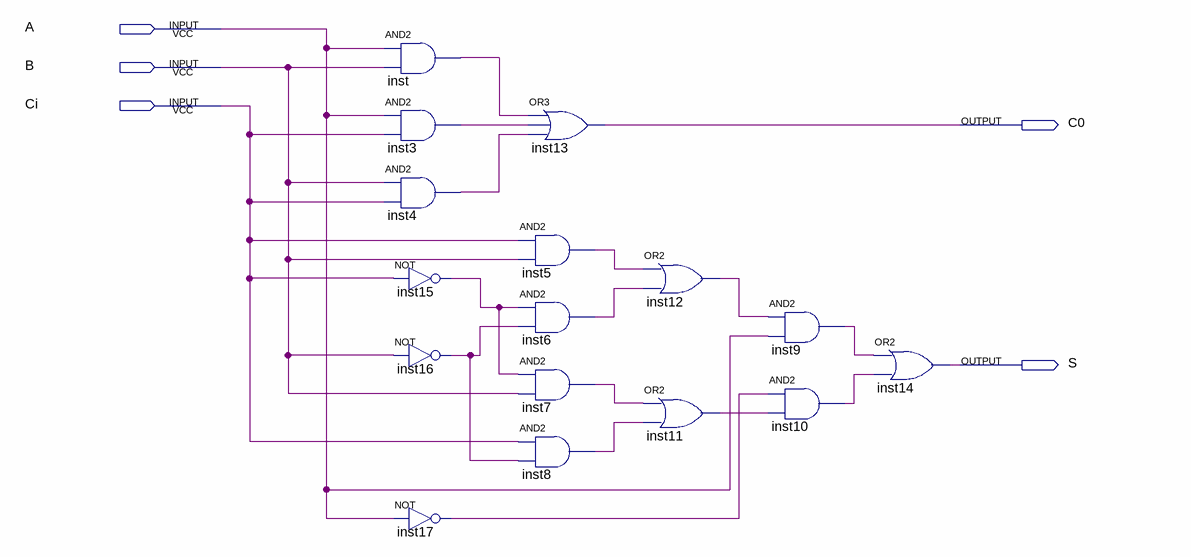
[diagram p0: schematic sheet]
// Quartus schematic fulladder_1b.bdf as structural Verilog: 16 symbols, 5 pins
module fulladder_1b (
  input  A,
  input  B,
  input  Ci,
  output C0,
  output S
);

  wire inst3_out, inst4_out, inst5_out, inst6_out, inst7_out, inst8_out, inst9_out, inst10_out, inst11_out,
       inst12_out, inst15_out, inst16_out, inst17_out, inst_out;

  and inst (inst_out, A, B);
  and inst3 (inst3_out, A, Ci);
  and inst4 (inst4_out, B, Ci);
  not inst15 (inst15_out, Ci);
  not inst16 (inst16_out, B);
  not inst17 (inst17_out, A);
  and inst5 (inst5_out, Ci, B);
  and inst6 (inst6_out, inst15_out, inst16_out);
  and inst7 (inst7_out, inst15_out, B);
  and inst8 (inst8_out, Ci, inst16_out);
  or inst13 (C0, inst_out, inst3_out, inst4_out);
  or inst12 (inst12_out, inst5_out, inst6_out);
  or inst11 (inst11_out, inst7_out, inst8_out);
  and inst9 (inst9_out, inst12_out, A);
  and inst10 (inst10_out, inst17_out, inst11_out);
  or inst14 (S, inst9_out, inst10_out);
endmodule
